# EAGLE design main (EAGLE 9.6.2)
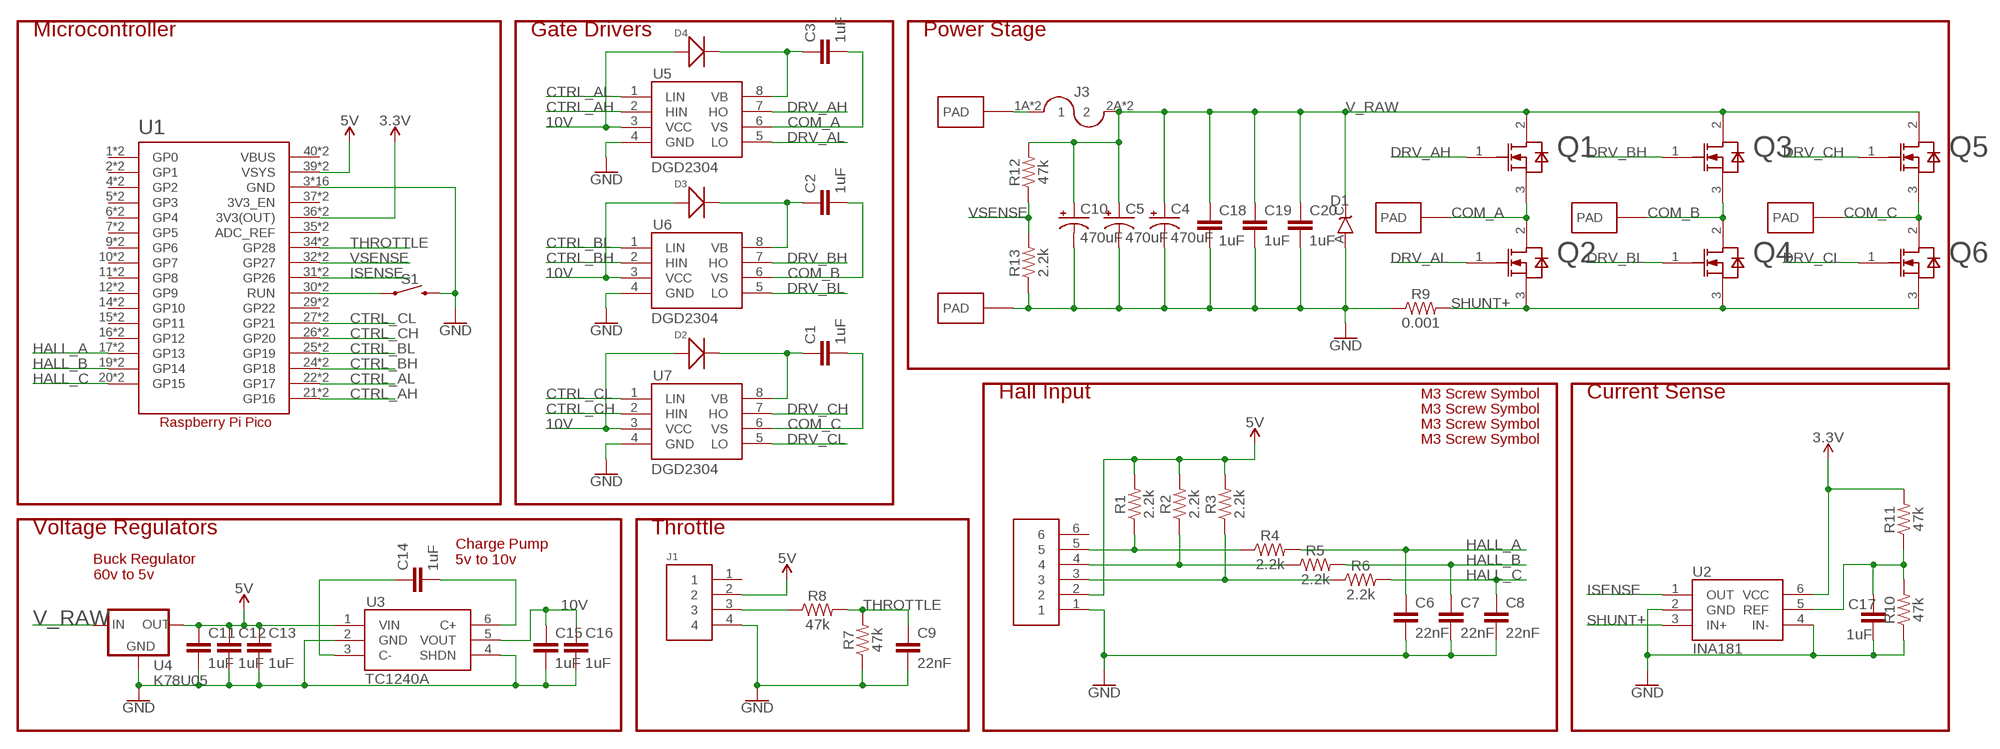
[diagram p0: schematic, sheet 1]

## Parts
C1  1uF  1.0UF-1206-50V-10%  [1206]
C2  1uF  1.0UF-1206-50V-10%  [1206]
C3  1uF  1.0UF-1206-50V-10%  [1206]
C4  470uF  1000UF-RADIAL-5MM-25V-20%  [CPOL-RADIAL-5MM-10MM]
C5  470uF  1000UF-RADIAL-5MM-25V-20%  [CPOL-RADIAL-5MM-10MM]
C6  22nF  1.0UF-1206-50V-10%  [1206]
C7  22nF  1.0UF-1206-50V-10%  [1206]
C8  22nF  1.0UF-1206-50V-10%  [1206]
C9  22nF  1.0UF-1206-50V-10%  [1206]
C10  470uF  1000UF-RADIAL-5MM-25V-20%  [CPOL-RADIAL-5MM-10MM]
C11  1uF  1.0UF-1206-50V-10%  [1206]
C12  1uF  1.0UF-1206-50V-10%  [1206]
C13  1uF  1.0UF-1206-50V-10%  [1206]
C14  1uF  1.0UF-1206-50V-10%  [1206]
C15  1uF  1.0UF-1206-50V-10%  [1206]
C16  1uF  1.0UF-1206-50V-10%  [1206]
C17  1uF  1.0UF-1206-50V-10%  [1206]
C18  1uF  1.0UF-1206-50V-10%  [1206]
C19  1uF  1.0UF-1206-50V-10%  [1206]
C20  1uF  1.0UF-1206-50V-10%  [1206]
D1  TVS  TVS_UNIDO-214AC  [DO-214AC]
D2  SMD-DIODE-100V-200MA(SOD-123)  [SOD-123]
D3  SMD-DIODE-100V-200MA(SOD-123)  [SOD-123]
D4  SMD-DIODE-100V-200MA(SOD-123)  [SOD-123]
J1  HEADER4VALULOK  [4PINVALULOK]
J2  HEADER6  [6PINVALULOK]
J3  FUSE  [AUTO_FUSE]
Q1  IRF135S203  [TO254P1524X508-4_3N]
Q2  IRF135S203  [TO254P1524X508-4_3N]
Q3  IRF135S203  [TO254P1524X508-4_3N]
Q4  IRF135S203  [TO254P1524X508-4_3N]
Q5  IRF135S203  [TO254P1524X508-4_3N]
Q6  IRF135S203  [TO254P1524X508-4_3N]
R1  2.2k  RESISTOR1206  [1206]
R2  2.2k  RESISTOR1206  [1206]
R3  2.2k  RESISTOR1206  [1206]
R4  2.2k  RESISTOR1206  [1206]
R5  2.2k  RESISTOR1206  [1206]
R6  2.2k  RESISTOR1206  [1206]
R7  47k  RESISTOR1206  [1206]
R8  47k  RESISTOR1206  [1206]
R9  0.001  RESISTOR  [R2512]
R10  47k  RESISTOR1206  [1206]
R11  47k  RESISTOR1206  [1206]
R12  47k  RESISTOR1206  [1206]
R13  2.2k  RESISTOR1206  [1206]
S1  MOMENTARY-SWITCH-SPST-PTH-6.0MM  [TACTILE_SWITCH_PTH_6.0MM]
U1  RASPBERRY_PICO-NO_DEBUG  [PICO-PKG-NO_DEBUG]
U2  INA181  [SOT23-6]
U3  TC1240A  [SOT23-6]
U4  K78U05  V_REG_78XX  [V78W_BACKWARDS]
U5  DGD2304  [SOIC8]
U6  DGD2304  [SOIC8]
U7  DGD2304  [SOIC8]
U$4  PAD  [PAD]
U$5  PAD  [PAD]
U$6  PAD  [PAD]
U$7  PAD  [PAD]
U$8  PAD  [PAD]
U$10  SCREW  [M3HOLE]
U$11  SCREW  [M3HOLE]
U$12  SCREW  [M3HOLE]
U$13  SCREW  [M3HOLE]

## Nets
3.3V: R11.2 U1.36(3V3(OUT)) U1.P$36(3V3(OUT)) U2.6(VCC)
5V: C11.1 C12.1 C13.1 J1.2 J2.2 R1.2 R2.2 R3.2 U1.39(VSYS) U1.P$39(VSYS) U3.1(VIN) U4.OUT
10V: C15.1 C16.1 D2.+ D3.+ D4.+ U3.5(VOUT) U5.3(VCC) U6.3(VCC) U7.3(VCC)
COM_A: C3.2 Q1.3(SOURCE) Q2.2(DRAIN) U5.6(VS) U$6.PAD
COM_B: C2.2 Q3.3(SOURCE) Q4.2(DRAIN) U6.6(VS) U$7.PAD
COM_C: C1.2 Q5.3(SOURCE) Q6.2(DRAIN) U7.6(VS) U$8.PAD
CTRL_AH: U1.21(GP16) U1.P$21(GP16) U5.2(HIN)
CTRL_AL: U1.22(GP17) U1.P$22(GP17) U5.1(LIN)
CTRL_BH: U1.24(GP18) U1.P$24(GP18) U6.2(HIN)
CTRL_BL: U1.25(GP19) U1.P$25(GP19) U6.1(LIN)
CTRL_CH: U1.26(GP20) U1.P$26(GP20) U7.2(HIN)
CTRL_CL: U1.27(GP21) U1.P$27(GP21) U7.1(LIN)
DRV_AH: Q1.1(GATE) U5.7(HO)
DRV_AL: Q2.1(GATE) U5.5(LO)
DRV_BH: Q3.1(GATE) U6.7(HO)
DRV_BL: Q4.1(GATE) U6.5(LO)
DRV_CH: Q5.1(GATE) U7.7(HO)
DRV_CL: Q6.1(GATE) U7.5(LO)
GND: C4.- C5.- C6.2 C7.2 C8.2 C9.2 C10.- C11.2 C12.2 C13.2 C15.2 C16.2 C17.2 C18.2 C19.2 C20.2 D1.A J1.4 J2.1 R7.1 R9.1 R10.1 R13.1 S1.3 U1.3(GND) U1.8(GND) U1.13(GND) U1.18(GND) U1.23(GND) U1.28(GND) U1.33(GND) U1.38(GND) U1.P$3(GND) U1.P$8(GND) U1.P$13(GND) U1.P$18(GND) U1.P$23(GND) U1.P$28(GND) U1.P$33(GND) U1.P$38(GND) U2.2(GND) U2.4(IN-) U3.2(GND) U3.4(SHDN) U4.GND U5.4(GND) U6.4(GND) U7.4(GND) U$5.PAD
HALL_A: C6.1 R4.2 U1.17(GP13) U1.P$17(GP13)
HALL_B: C7.1 R5.2 U1.19(GP14) U1.P$19(GP14)
HALL_C: C8.1 R6.2 U1.20(GP15) U1.P$20(GP15)
ISENSE: U1.31(GP26) U1.P$31(GP26) U2.1(OUT)
N$1: C2.1 D3.- U6.8(VB)
N$2: J2.3 R3.1 R6.1
N$3: C3.1 D4.- U5.8(VB)
N$4: J2.4 R2.1 R5.1
N$6: J2.5 R1.1 R4.1
N$7: J1.3 R8.1
N$8: C1.1 D2.- U7.8(VB)
N$9: S1.1 U1.30(RUN) U1.P$30(RUN)
N$10: C17.1 R10.2 R11.1 U2.5(REF)
N$18: C14.1 U3.3(C-)
N$19: C14.2 U3.6(C+)
SHUNT+: Q2.3(SOURCE) Q4.3(SOURCE) Q6.3(SOURCE) R9.2 U2.3(IN+)
THROTTLE: C9.1 R7.2 R8.2 U1.34(GP28) U1.P$34(GP28)
V_PREFUSE: J3.1A J3.1B U$4.PAD
V_RAW: C4.+ C5.+ C10.+ C18.1 C19.1 C20.1 D1.C J3.2A J3.2B Q1.2(DRAIN) Q3.2(DRAIN) Q5.2(DRAIN) R12.2 U4.IN
VSENSE: R12.1 R13.2 U1.32(GP27) U1.P$32(GP27)
Unconnected: J1.1 J2.6 U1.1(GP0) U1.2(GP1) U1.4(GP2) U1.5(GP3) U1.6(GP4) U1.7(GP5) U1.9(GP6) U1.10(GP7) U1.11(GP8) U1.12(GP9) U1.14(GP10) U1.15(GP11) U1.16(GP12) U1.29(GP22) U1.35(ADC_REF) U1.37(3V3_EN) U1.P$1(GP0) U1.P$2(GP1) U1.P$4(GP2) U1.P$5(GP3) U1.P$6(GP4) U1.P$7(GP5) U1.P$9(GP6) U1.P$10(GP7) U1.P$11(GP8) U1.P$12(GP9) U1.P$14(GP10) U1.P$15(GP11) U1.P$16(GP12) U1.P$29(GP22) U1.P$35(ADC_REF) U1.P$37(3V3_EN)

## Notes on the sheet
- Microcontroller | Gate Drivers | Power Stage
- Hall Input | Current Sense
- Voltage Regulators | Throttle
- Charge Pump
  5v to 10v
- Buck Regulator
  60v to 5v

## Power pins joined to a net without a drawn wire
VBUS: U1.40(VBUS) U1.P$40(VBUS)

## Library data of the parts
C1-C3 C6-C9 C11-C20 = SparkFun-Capacitors:1.0UF: 1µF ceramic capacitors A capacitor is a passive two-terminal electrical component used to store electrical energy temporarily in an electric field.; PROD_ID: CAP-09822; VALUE: 1.0uF
C4 C5 C10 = SparkFun-Capacitors:1000UF: 1,000µF/1mF ceramic capacitors A capacitor is a passive two-terminal electrical component used to store electrical energy temporarily in an electric field. CAP-08070; PROD_ID: CAP-09538; VALUE: 1mF
D1 = 2018:TVS_UNI
D2-D4 = Seeed-Diode:SMD-DIODE-100V-200MA(SOD-123): 304010007; MPN: MMSD4148; VALUE: MMSD4148-sod123
J1 = Custom_old:HEADER4
J2 = Custom_old:HEADER6
J3 = Custom_old:FUSE
Q1-Q6 = IRF135S203:IRF135S203: IRF135S203 TO254P1524X508-4_3N Insulated-Gate Field-Effect Transistor (IGFET), N-Channel, Enhancement, Body Diode, Pin 1 Gate, 2 Drain, 3 Source, 3 Pins
R1-R8 R10-R13 = SparkFun-Resistors:RESISTOR: Generic Resistor Package
R9 = Custom_old:RESISTOR
S1 = SparkFun-Switches:MOMENTARY-SWITCH-SPST: Momentary Switch (Pushbutton) - SPST Normally-open (NO) SPST momentary switches (buttons, pushbuttons). Variants PTH-12MM - 12mm square, through-hole Momentary Pushbutton Switch - 12mm Square <https://www.sparkfun.com/products/9190> (COM-09190) PTH-6.0MM, PTH-6.0MM-KIT - 6.0mm square, through-hole Mini Pushbutton Switch <https://www.sparkfun.com/products/97> (COM-00097) KIT package intended for soldering kit's - only one side of pads' copper is exposed. PTH-RIGHT-ANGLE-KIT - Right-angle, through-hole Right Angle Tactile Button <https://www.sparkfun.com/products/10791> - Used on SparkFun BigTime Watch Kit <https://www.sparkfun.com/products/11734> SMD-12MM - 12mm square, surface-mount Tactile Button - SMD (12mm) <https://www.sparkfun.com/products/12993> (COM-12993) Used on SparkFun PicoBoard <https://www.sparkfun.com/products/11888> SMD-4.5MM - 4.5mm Square Trackball Switch Used on SparkFun Blackberry Trackballer Breakout <https://www.sparkfun.com/products/13169> SMD-4.6MMX2.8MM - 4.60mm x 2.80mm, surface mount Used on SparkFun SAMD21 Mini Breakout <https://www.sparkfun.com/products/13664> SMD-5.2MM, SMD-5.2-REDUNDANT - 5.2mm square, surface-mount Mini Pushbutton Switch - SMD <https://www.sparkfun.com/products/8720> (COM-08720) Used on Arduino Pro Mini <https://www.sparkfun.com/products/11114> REDUNDANT package connects both switch circuits together SMD-6.0X3.5MM - 6.0 x 3.5mm, surface mount Momentary Reset Switch SMD <https://www.sparkfun.com/products/8229> (COM-08229) SMD-6.2MM-TALL - 6.2mm square, surface mount Tactile Button - SMD (6mm) <https://www.sparkfun.com/products/12992> Used on SparkFun Digital Sandbox <https://www.sparkfun.com/products/12651> SMD-RIGHT-ANGLE - Right-angle, surface mount Used on SparkFun Block for Intel® Edison - Arduino <https://www.sparkfun.com/products/13036>; PROD_ID: SWCH-08441; SF_SKU: COM-00097
U1 = RpiPico:RASPBERRY_PICO-NO_DEBUG
U2 = Custom_old:INA181
U3 = Custom_old:TC1240A
U4 = 2018:V_REG_78XX: Voltage Regulator Standard 7805 5V regulator. IGO (Input Ground Output). Spark Fun Electronics SKU : COM-00107
U5-U7 = Custom_old:DGD2304
U$4-U$8 = Custom_old:PAD
U$10-U$13 = Custom_old:SCREW

## Net classes
0 default: clearance 0.205 mm

## Board
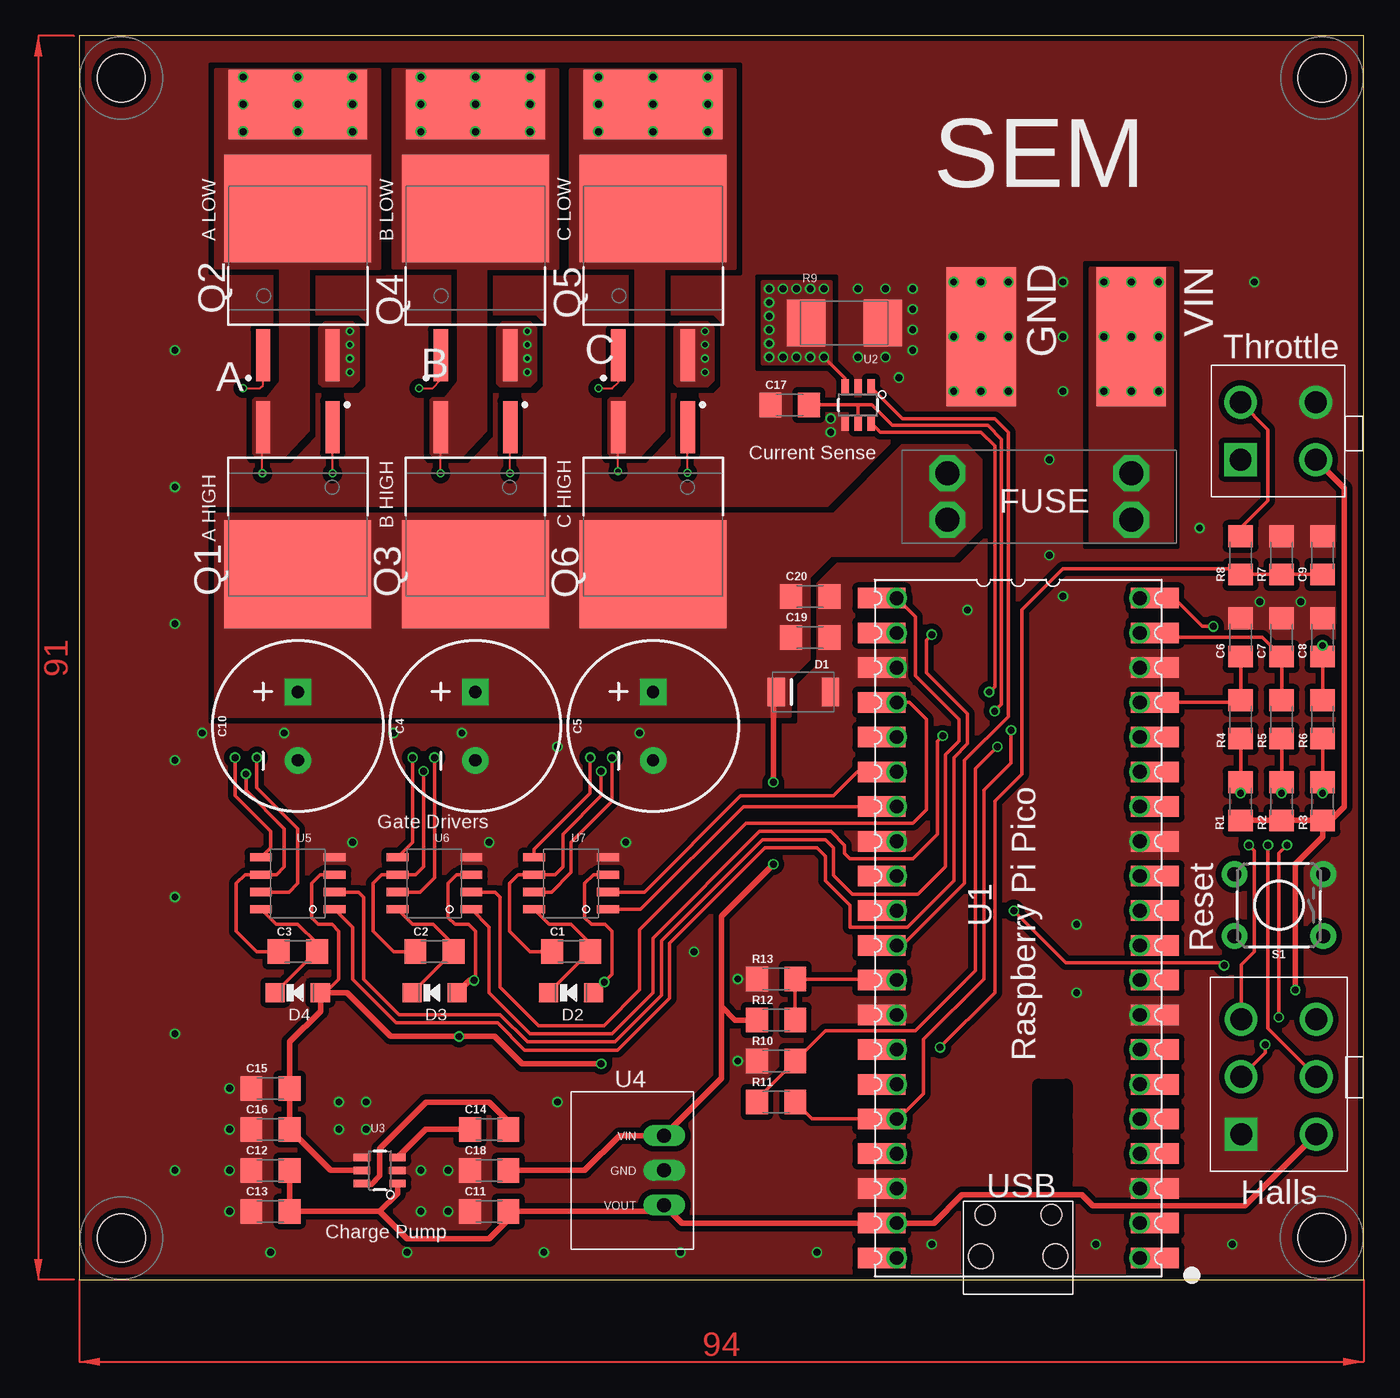
[diagram p1: board, top side]
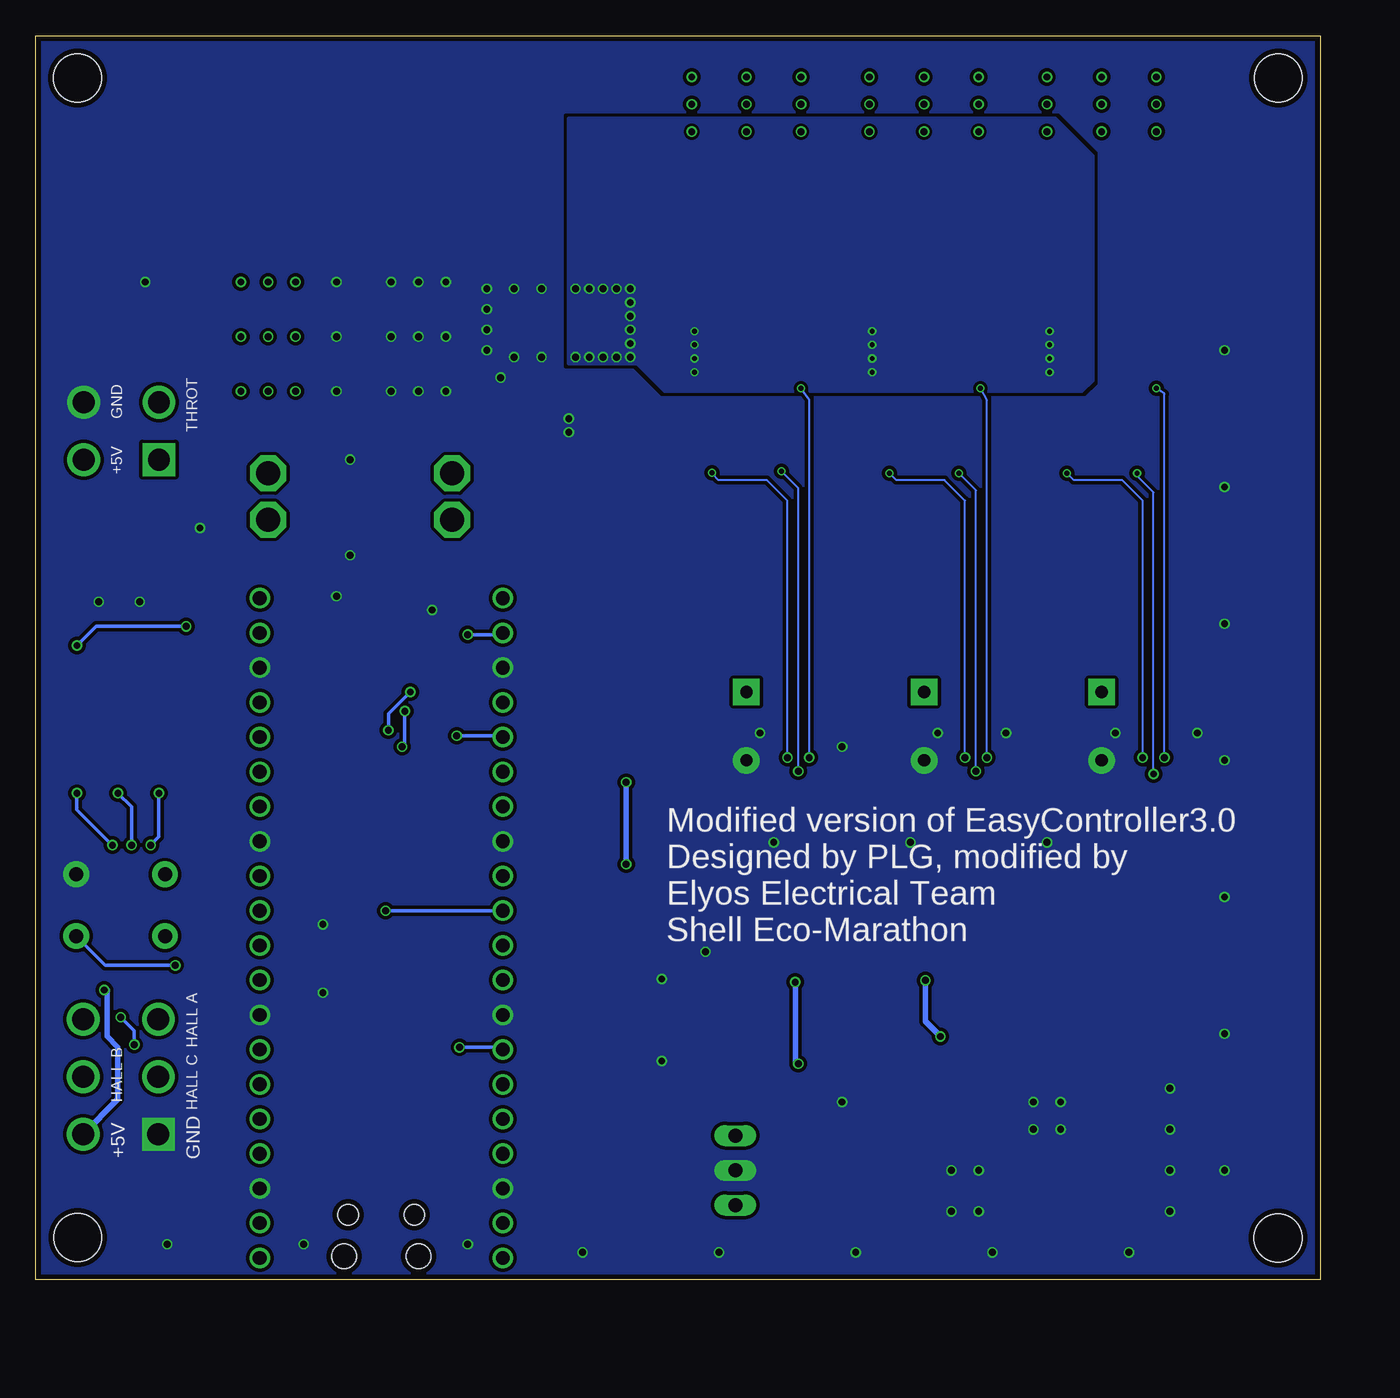
[diagram p2: board, bottom side, seen from below]

Size 94 x 91 mm. Coordinates in mm from the lower left corner, seen from the top.
Outline: 0,0 94,0 94,91 0,91 0,0
Copper layers (1*16): Top 0.035559375mm / dielectric 1.6mm / Bottom 0.035559375mm
Design rules "jlcpcb2layer *": minimum track width 6mil, minimum drill 10mil, track to track 5mil, track to pad 6mil, pad to pad 6mil, via to via 6mil, smd to smd 6mil, copper to edge 15mil, drill to drill 6mil, minimum pad ring 5mil, minimum via ring 5mil, stop-mask expansion 2.5mil, vias tented up to drill 25mil, thermal gap 10mil

### Footprints (pad centres in the part's own frame; a part is rotated, then mirrored left to right if it is on the bottom)
1206 = smd 1.6 x 1.8: 1 -1.4,0; 2 1.4,0
CPOL-RADIAL-5MM-10MM = drill 0.9 pad 1.93 square: + 2.5,0 | drill 0.9 pad 1.93: - -2.5,0
DO-214AC = smd 1.27 x 2.1: A 1.985,0; C -1.985,0
SOD-123 = smd 1.397 x 1.397: + -1.651,0; - 1.651,0
4PINVALULOK = drill 1.6 square: 1 0,5.5 | drill 1.6: 2 0,0; 3 4.2,5.5; 4 4.2,0
6PINVALULOK = drill 1.6 square: 1 -6.35,2.96 | drill 1.6: 2 -6.35,-2.54; 3 -2.15,2.96; 4 -2.15,-2.54; 5 2.05,2.96; 6 2.05,-2.54
AUTO_FUSE = drill 1.75 octagon: 1A 0,3.4; 1B 0,0; 2A 13.47,3.4; 2B 13.47,0
TO254P1524X508-4_3N = smd 3.8 x 1.05: 1 -5.375,2.54; 3 -5.375,-2.54 | smd 7.9 x 10.75: 2 5.375,0
R2512 = smd 2.8 x 3.4: 1 -2.8,0; 2 2.8,0
TACTILE_SWITCH_PTH_6.0MM = drill 1.016 pad 1.88: 1 -3.251,2.261; 2 3.251,2.261; 3 -3.251,-2.261; 4 3.251,-2.261
PICO-PKG-NO_DEBUG = drill 1: 1 -7.62,25.4; 2 -7.62,22.86; 3 -7.62,20.32; 4 -7.62,17.78; 5 -7.62,15.24; 6 -7.62,12.7; 7 -7.62,10.16; 8 -7.62,7.62; 9 -7.62,5.08; 10 -7.62,2.54; 11 -7.62,0; 12 -7.62,-2.54; 13 -7.62,-5.08; 14 -7.62,-7.62; 15 -7.62,-10.16; 16 -7.62,-12.7; 17 -7.62,-15.24; 18 -7.62,-17.78; 19 -7.62,-20.32; 20 -7.62,-22.86; 21 10.16,-22.86; 22 10.16,-20.32; 23 10.16,-17.78; 24 10.16,-15.24; 25 10.16,-12.7; 26 10.16,-10.16; 27 10.16,-7.62; 28 10.16,-5.08; 29 10.16,-2.54; 30 10.16,0; 31 10.16,2.54; 32 10.16,5.08; 33 10.16,7.62; 34 10.16,10.16; 35 10.16,12.7; 36 10.16,15.24; 37 10.16,17.78; 38 10.16,20.32; 39 10.16,22.86; 40 10.16,25.4 | smd 3.5 x 1.5: P$1 -8.73,25.4; P$2 -8.73,22.86; P$3 -8.73,20.32; P$4 -8.73,17.78; P$5 -8.73,15.24; P$6 -8.73,12.7; P$7 -8.73,10.16; P$8 -8.73,7.62; P$9 -8.73,5.08; P$10 -8.73,2.54; P$11 -8.73,0; P$12 -8.73,-2.54; P$13 -8.73,-5.08; P$14 -8.73,-7.62; P$15 -8.73,-10.16; P$16 -8.73,-12.7; P$17 -8.73,-15.24; P$18 -8.73,-17.78; P$19 -8.73,-20.32; P$20 -8.73,-22.86; P$21 11.27,-22.86; P$22 11.27,-20.32; P$23 11.27,-17.78; P$24 11.27,-15.24; P$25 11.27,-12.7; P$26 11.27,-10.16; P$27 11.27,-7.62; P$28 11.27,-5.08; P$29 11.27,-2.54; P$30 11.27,0; P$31 11.27,2.54; P$32 11.27,5.08; P$33 11.27,7.62; P$34 11.27,10.16; P$35 11.27,12.7; P$36 11.27,15.24; P$37 11.27,17.78; P$38 11.27,20.32; P$39 11.27,22.86; P$40 11.27,25.4 | hole 1.8: -1.455,25.27; 3.995,25.27 | hole 1.5: -1.155,22.24; 3.695,22.24
SOT23-6 = smd 0.55 x 1.2: 1 -0.95,-1.3; 2 0,-1.3; 3 0.95,-1.3; 4 0.95,1.3; 5 0,1.3; 6 -0.95,1.3
V78W_BACKWARDS = drill 1.016 long: GND 0,-3.81; IN 2.54,-3.81; OUT -2.54,-3.81
SOIC8 = smd 1.6 x 0.6: 1 -2.7,1.905; 2 -2.7,0.635; 3 -2.7,-0.635; 4 -2.7,-1.905; 5 2.7,-1.905; 6 2.7,-0.635; 7 2.7,0.635; 8 2.7,1.905
PAD = smd 10.16 x 5.08: PAD 0,0
M3HOLE = hole 3.5: 0,0

### Placement (x,y rotation side)
C1  36,24 180 top
C2  26,24 180 top
C3  16,24 180 top
C4  29,40.5 90 top
C5  42,40.5 90 top
C6  85,47 90 top
C7  88,47 90 top
C8  91,47 90 top
C9  91,53 90 top
C10  16,40.5 90 top
C11  30,5 180 top
C12  14,8 180 top
C13  14,5 180 top
C14  30,11 0 top
C15  14,14 180 top
C16  14,11 180 top
C17  52,64 180 top
C18  30,8 180 top
C19  53.5,47 0 top
C20  53.5,50 0 top
D1  53,43 0 top
D2  36,21 180 top
D3  26,21 180 top
D4  16,21 180 top
J1  90.5,60 90 top
J2  88,17 90 top
J3  77,59 180 top
Q1  16,57 270 top
Q2  16,73 90 top
Q3  29,57 270 top
Q4  29,73 90 top
Q5  42,57 270 top
Q6  42,73 90 top
R1  85,35 270 top
R2  88,35 270 top
R3  91,35 270 top
R4  85,41 90 top
R5  88,41 90 top
R6  91,41 90 top
R7  88,53 270 top
R8  85,53 270 top
R9  56,70 180 top
R10  51,16 0 top
R11  51,13 0 top
R12  51,19 180 top
R13  51,22 0 top
S1  87.8,27.4 180 top
U1  70,27 180 top
U2  57,64 180 top
U3  22,8 90 top
U4  39,8 90 top
U5  16,29 180 top
U6  26,29 180 top
U7  36,29 180 top
U$4  77,69 90 top
U$5  66,69 270 top
U$6  16,86 0 top
U$7  29,86 0 top
U$8  42,86 0 top
U$10  90.96,87.93 0 top
U$11  90.95,3.09 0 top
U$12  3.09,3.06 0 top
U$13  3.08,87.93 0 top

### Tracks (layer width: path | path; a pad name or v marks a point on that pad's centre or on a via)
3.3V  (via drill 0.5)
  Top 0.254: U2.6 58.65,62 66,62 67,61 67,43.4 v66.6,43 | v68.2,40.2 68.2,37.8 66.2,35.8 66.2,22 61.8,17.6 61.8,13.6 59.96,11.76 U1.36 | R11.2 53.64,11.76 U1.36 | U1.P$36 U1.36
  Bottom 0.254: v66.6,43 68.2,41.4 v68.2,40.2
5V  (via drill 0.5)
  Top 0.406: J2.2 85.29,5.4 74.2,5.4 73.4,6.2 64.6,6.2 62.54,4.14 U1.39 | R1.2 R2.2 R3.2 | R3.2 91,32.4 89,30.4 v89,21.2 | J1.2 92.6,57.9 92.6,34.6 91.6,33.6 R3.2 | C12.1 C13.1 22,5 | 22,5 24,3 30,3 31.4,4.4 C11.1 42.35,5 U4.OUT 44.13,4.14 U1.39 | U3.1 23.3,6.3 22,5 | U1.P$39 U1.39
  Bottom 0.406: J2.2 88,13.19 88,17 88.8,17.8 88.8,21.2 v89,21.2
10V  (via drill 0.5)
  Top 0.254: U6.3 27.64,29.64 27,29 27,26.5 27.5,26 28.5,26 29,25.5 29,22 v28.9,21.9 | U5.3 17.63,29.64 17,29 17,26.5 17.5,26 18.5,26 19,25.5 19,22 18,21 D4.+ | U7.3 37.63,29.64 37,29 37,26.5 37.5,26 38.5,26 39,25.5 39,22.35 v38.42,21.77
  Top 0.406: U3.5 18.4,8 C16.1 C15.1 15.4,17.4 17.65,19.65 D4.+ | D3.+ 28.55,21.9 v28.9,21.9 | 18,21 19.6,21 22.8,17.8 v27.8,17.8 30.4,17.8 32.4,15.8 v38.2,15.8 | D2.+ v38.42,21.77
  Bottom 0.406: v28.9,21.9 28.9,18.9 v27.8,17.8 | v38.42,21.77 38.42,16.03 v38.2,15.8
COM_A  (via drill 0.35, 0.5)
  Top 0.152: v13.4,59 13.4,62.31 Q1.3
  Top 0.254: C3.2 13,24 11.5,25.5 11.5,29 12.13,29.64 U5.6 14.44,29.64 15,30.2 15,33 12.2,35.8 v12.2,37
  Bottom 0.152: v12.2,37 12.2,57.6 13.4,58.8 v13.4,59
  other vias: 16,86 12,88 12,86 12,84 16,84 16,88 20,88 20,86 20,84
  pour Top (isolate 0.406, rank 2, no thermals): 13.77,64.46 12.87,64.46 12.76,64.35 12.76,60.46 12.92,60.3 15.03,60.3 16.75,62.13 16.75,73.99 22,73.99 22,88.53 9.97,88.53 9.97,74.03 14.75,74.03 14.75,65.69
COM_B  (via drill 0.35, 0.5)
  Top 0.152: v26.45,59 26.46,59.08 Q3.3
  Top 0.254: C2.2 23,24 21.5,25.5 21.5,29 22.14,29.64 U6.6 24.64,29.64 25.2,30.2 v25.2,37.2
  Bottom 0.152: v25.2,37.2 25.2,57.75 v26.45,59
  other vias: 29,86 25,84 25,86 25,88 29,88 29,84 33,84 33,86 33,88
  pour Top (isolate 0.406, rank 2, no thermals): 26.77,64.46 25.87,64.46 25.76,64.35 25.76,60.46 25.92,60.3 28.03,60.3 29.75,62.13 29.75,73.99 29.87,74 35,74 35,88.53 22.97,88.53 22.97,74.03 27.75,74.03 27.75,65.69
COM_C  (via drill 0.35, 0.5)
  Top 0.152: v39.44,59.15 39.44,62.35 Q5.3
  Top 0.254: C1.2 33,24 31.5,25.5 31.5,29 32.14,29.64 U7.6 34.84,29.64 35.4,30.2 35.4,32.6 38.2,35.4 v38.2,37.2
  Bottom 0.152: v38.2,37.2 38.2,57.9 v39.44,59.14 v39.44,59.15
  other vias: 42,86 38,88 38,86 38,84 42,84 42,88 46,88 46,86 46,84
  pour Top (isolate 0.406, rank 2, no thermals): 39.77,64.46 38.87,64.46 38.76,64.35 38.76,60.46 38.92,60.3 41.03,60.3 42.75,62.13 42.75,73.99 42.87,74 48,74 48,88.53 47.99,88.54 35.97,88.54 35.97,74.03 40.75,74.03 40.75,65.69
CTRL_AH
  Top 0.254: U5.2 20.43,28.36 20.8,28 20.8,22 23.4,19.4 30.8,19.4 32.8,17.4 39.2,17.4 42.6,20.8 42.6,24.8 50,32.2 54.6,32.2 55.2,31.6 55.2,29.6 56.6,28.2 61.4,28.2 63.4,30.2 63.4,38.4 64.4,39.4 64.4,41 61.2,44.2 61.2,48.5 U1.21 U1.P$21
CTRL_AL  (via drill 0.5)
  Top 0.254: U5.1 20,25.8 20,22 23.2,18.8 30.6,18.8 32.6,16.8 39.4,16.8 43.2,20.6 43.2,24.6 50.2,31.6 54,31.6 54.6,31 54.6,29.2 56.4,27.4 56.4,25.8 60.6,25.8 64,29.2 64,38.2 65,39.2 65,41.4 62,44.4 62,46.8 v62.4,47.2 | U1.P$22 U1.22
  Bottom 0.254: v62.4,47.2 59.96,47.2 U1.22
CTRL_BH
  Top 0.254: U6.2 30.43,28.36 30.8,28 30.8,21.4 33.6,18.6 38.4,18.6 41,21.2 41,25.6 48.8,33.4 61,33.4 62,34.4 62,41 60.76,42.24 60,42.24 U1.24 U1.P$24
CTRL_BL  (via drill 0.5)
  Top 0.254: U6.1 30,25.8 30,21 33,18 39,18 42,21 42,25 49.8,32.8 55,32.8 56,31.8 56,31.2 56.4,30.8 61,30.8 62.8,32.6 62.8,39.4 v63.2,39.8 | U1.P$25 U1.25
  Bottom 0.254: v63.2,39.8 59.94,39.8 U1.25
CTRL_CH
  Top 0.254: U7.2 41.37,28.36 48.4,35.4 55.2,35.4 56.96,37.16 U1.P$26 59,37.16 U1.26
CTRL_CL
  Top 0.254: U7.1 41.09,27.09 48.62,34.62 U1.P$27 59,34.62 U1.27
DRV_AH  (via drill 0.35, 0.5)
  Top 0.152: v18.54,59 Q1.1
  Top 0.254: v13,38.2 13,36 16,33 16,29 15.37,28.36 U5.7
  Bottom 0.152: v13,38.2 13,57 14.5,58.5 18.04,58.5 v18.54,59
DRV_AL  (via drill 0.35, 0.5)
  Top 0.152: v12,65.22 13.22,65.22 13.46,65.46 Q2.1
  Top 0.254: v11.4,38.2 11.4,35.4 14,32.8 14,31.61 U5.5
  Bottom 0.152: v11.4,38.2 11.4,64.81 v12,65.22
DRV_BH  (via drill 0.35, 0.5)
  Top 0.152: v31.53,59 31.53,62.37 Q3.1
  Top 0.254: U6.7 24.96,28.36 26,29.4 v26,38.2
  Bottom 0.152: v26,38.2 26,57 27.5,58.5 31.03,58.5 v31.53,59
DRV_BL  (via drill 0.35, 0.5)
  Top 0.152: v24.87,65.22 25.85,65.22 26.46,65.83 Q4.1
  Top 0.254: v24.4,38.2 24.4,32.01 U6.5
  Bottom 0.152: v24.4,38.2 24.4,64.33 v24.87,65.22
DRV_CH  (via drill 0.35, 0.5)
  Top 0.152: v44.52,59.04 44.52,62.35 Q5.1
  Top 0.254: v39,38.2 39,35 36,32 36,29.8 34.56,28.36 U7.7
  Bottom 0.152: v39,38.2 39,57 40.5,58.5 40.54,58.5 41,58.5 44.03,58.5 44.53,59 v44.52,59.04
DRV_CL  (via drill 0.35, 0.5)
  Top 0.152: v38,65.22 39,65.22 39.46,65.68 Q6.1
  Top 0.254: v37.4,38.2 37.4,35.6 33.3,31.5 U7.5
  Bottom 0.152: v37.4,38.2 37.4,64.4 v38,65.22
GND  (via drill 0.5)
  other vias: 66,65 64,73 66,73 68,73 68,69 66,69 64,69 64,65 68,65 57,72.5 59,72.5 61,72.5 61,71 61,69.5 59,67.5 57,67.5 61,68 55,62 60,66 19,11 19,13 21,13 27,8 27,5 25,5 25,8 21,11 11,5 11,8 11,11 11,14 48.2,22 48.2,16 55,63 7,68 7,58 7,48 7,38 7,28 7,18 7,8 41,40 35,39 28,40 23,40 15,40 9,40 71,53 72,50 65,49 86,73 82,55 86.4,49.6 89.4,49.6 84.4,2.6 74.4,2.6 62.4,2.6 54,2 44,2 34,2 24,2 14,2 35,13 45,24 40,32 30,32 20,32 73,26 73,21 71,60 72,65 72,69 72,73
  pour Bottom (isolate 0.254, rank 5, no thermals): -9,93 -9,-2 96,-2 96,93
  pour Top (isolate 0.406, rank 5, no thermals): -8,92 -8,-1 95,-1 95,92
HALL_A
  Top 0.254: C6.1 R4.2 84.84,42.24 U1.P$17 U1.17
HALL_B
  Top 0.254: R5.2 C7.1 86.6,47 79.05,47 U1.P$19 U1.19
HALL_C  (via drill 0.5)
  Top 0.254: R6.2 C8.1 v91,46.4 | v83,47.8 82.2,47.8 80.14,49.86 U1.P$20 U1.20
  Bottom 0.254: v83,47.8 89.6,47.8 v91,46.4
ISENSE
  Top 0.254: U2.1 60.25,63 67,63 68,62 68,41.2 64.8,38 64.8,29 60.26,24.46 U1.P$31 U1.31
N$1
  Top 0.254: U6.8 24.39,26 25.9,26 27.4,24.5 C2.1 27.35,24 D3.-
N$2  (via drill 0.5)
  Top 0.254: J2.3 86.8,16.61 v86.8,17.2 | v87.8,19.2 87.8,31.2 v88.4,31.8 | v91,35.6 R3.1 R6.1
  Bottom 0.254: v86.8,17.2 86.8,18.2 v87.8,19.2 | v88.4,31.8 91,34.4 v91,35.6
N$3
  Top 0.254: U5.8 14.39,26 16,26 17.4,24.6 C3.1 17.35,24 D4.-
N$4  (via drill 0.5)
  Top 0.254: v88,35.6 R2.1 R5.1 | v87,31.8 87,18.39 J2.4
  Bottom 0.254: v88,35.6 87,34.6 v87,31.8
N$6  (via drill 0.5)
  Top 0.254: J2.5 85.04,23.04 86,24 86,31.4 v85.6,31.8 | v85,35.6 R1.1 R4.1
  Bottom 0.254: v85.6,31.8 85,32.4 v85,35.6
N$7
  Top 0.254: J1.3 87,62.2 87,57 85,55 R8.1
N$8
  Top 0.254: U7.8 34.39,26 36,26 37.4,24.6 C1.1 37.35,24 D2.-
N$9  (via drill 0.5)
  Top 0.254: v68.4,27 72.2,23.2 83.6,23.2 v83.8,23 | U1.P$30 U1.30
  Bottom 0.254: S1.1 88.91,23 v83.8,23 | U1.30 v68.4,27
N$10  (via drill 0.5)
  Top 0.254: C17.1 57,64 | U2.5 57,64 | 57,64 58,64 59.5,62.5 66.5,62.5 67.5,61.5 67.5,42.1 v67,41.6 | v67.2,39 65.6,37.4 65.6,22.6 61.2,18.2 54.6,18.2 R10.2 49.6,13.2 R11.1
  Bottom 0.254: v67,41.6 67,39.2 v67.2,39
N$18
  Top 0.406: U3.3 25.35,11 C14.1
N$19
  Top 0.406: U3.6 20.75,7 21.4,7 22,7.6 22,9.6 25.4,13 30,13 31.4,11.6 C14.2
SHUNT+  (via drill 0.35, 0.5)
  Top 0.254: U2.3 56.05,65.95 v54.5,67.5
  other vias: 50.5,71.5 50.5,70.5 50.5,69.5 50.5,68.5 50.5,67.5 51.5,67.5 52.5,67.5 53.5,67.5 50.5,72.5 51.5,72.5 52.5,72.5 53.5,72.5 54.5,72.5 19.8,69.4 19.8,68.4 19.8,67.4 19.8,66.4 32.8,69.4 32.8,68.4 32.8,67.4 32.8,66.4 45.8,69.4 45.8,68.4 45.8,67.4 45.8,66.4
  pour Top (isolate 0.406, no thermals): 50,73 50,67 55,67 55,73
  pour Top (no thermals): 20,65.4 17.8,65.4 17.6,65.6 17.6,69.6 18,70 20,70 20.4,69.6 20.4,65.8
  pour Top (no thermals): 33,65.4 30.8,65.4 30.6,65.6 30.6,69.6 31,70 33,70 33.4,69.6 33.4,65.8
  pour Top (no thermals): 46,65.4 43.8,65.4 43.6,65.6 43.6,69.6 44,70 46,70 46.4,69.6 46.4,65.8
  pour Bottom: 55,84.98 55,67 50,67 48,65 17.43,65 16.66,65.77 16.66,82.25 19.39,84.98
THROTTLE  (via drill 0.5)
  Top 0.254: C9.1 R7.2 R8.2 84.6,52 72,52 69,49 69,37 67,35 67,21 v63,17 | U1.P$34 U1.34
  Bottom 0.254: U1.34 60,17 v63,17
V_PREFUSE  (via drill 0.5)
  other vias: 77,69 75,73 75,69 75,65 77,65 79,65 79,69 79,73 77,73
  pour Top (isolate 0.406, no thermals): 74,74 74,54 80,54 80,74
V_RAW  (via drill 0.5)
  Top 0.406: v50.8,30.4 47,26.6 47,20 | 47,20 48,19 R12.2 | D1.C 50.8,42.78 v50.8,36.4 | 47,20 47,14.73 U4.IN 39.54,10.54 37,8 C18.1
  Bottom 0.406: v50.8,36.4 v50.8,30.4
  pour Top (no thermals): 10,56 55.23,56 60.23,61 65,61 66,60 66,55 64,53 55,53 53.4,51.4 53.4,45.4 52,44 52,41.23 10,41.23
VBUS
  Top 0.254: U1.P$40 U1.40
VSENSE
  Top 0.254: R12.1 R13.2 59.76,22 U1.32 U1.P$32
(copper drawn outside any net)
  shapes: Top area x2

### Text on the board
tPlace: SEM | A LOW | B LOW | C LOW | VIN | GND | C | Throttle | B | A | Current Sense | FUSE | B HIGH | C HIGH | A HIGH | Gate Drivers | Reset | Raspberry Pi Pico | Halls | USB | Charge Pump
bPlace: THROT | GND | +5V | Modified version of EasyController3.0 / Designed by PLG, modified by / Elyos Electrical Team / Shell Eco-Marathon | HALL A | HALL B | HALL C | GND | +5V